# EAGLE design magnetorquer_board (EAGLE 8.4.1)
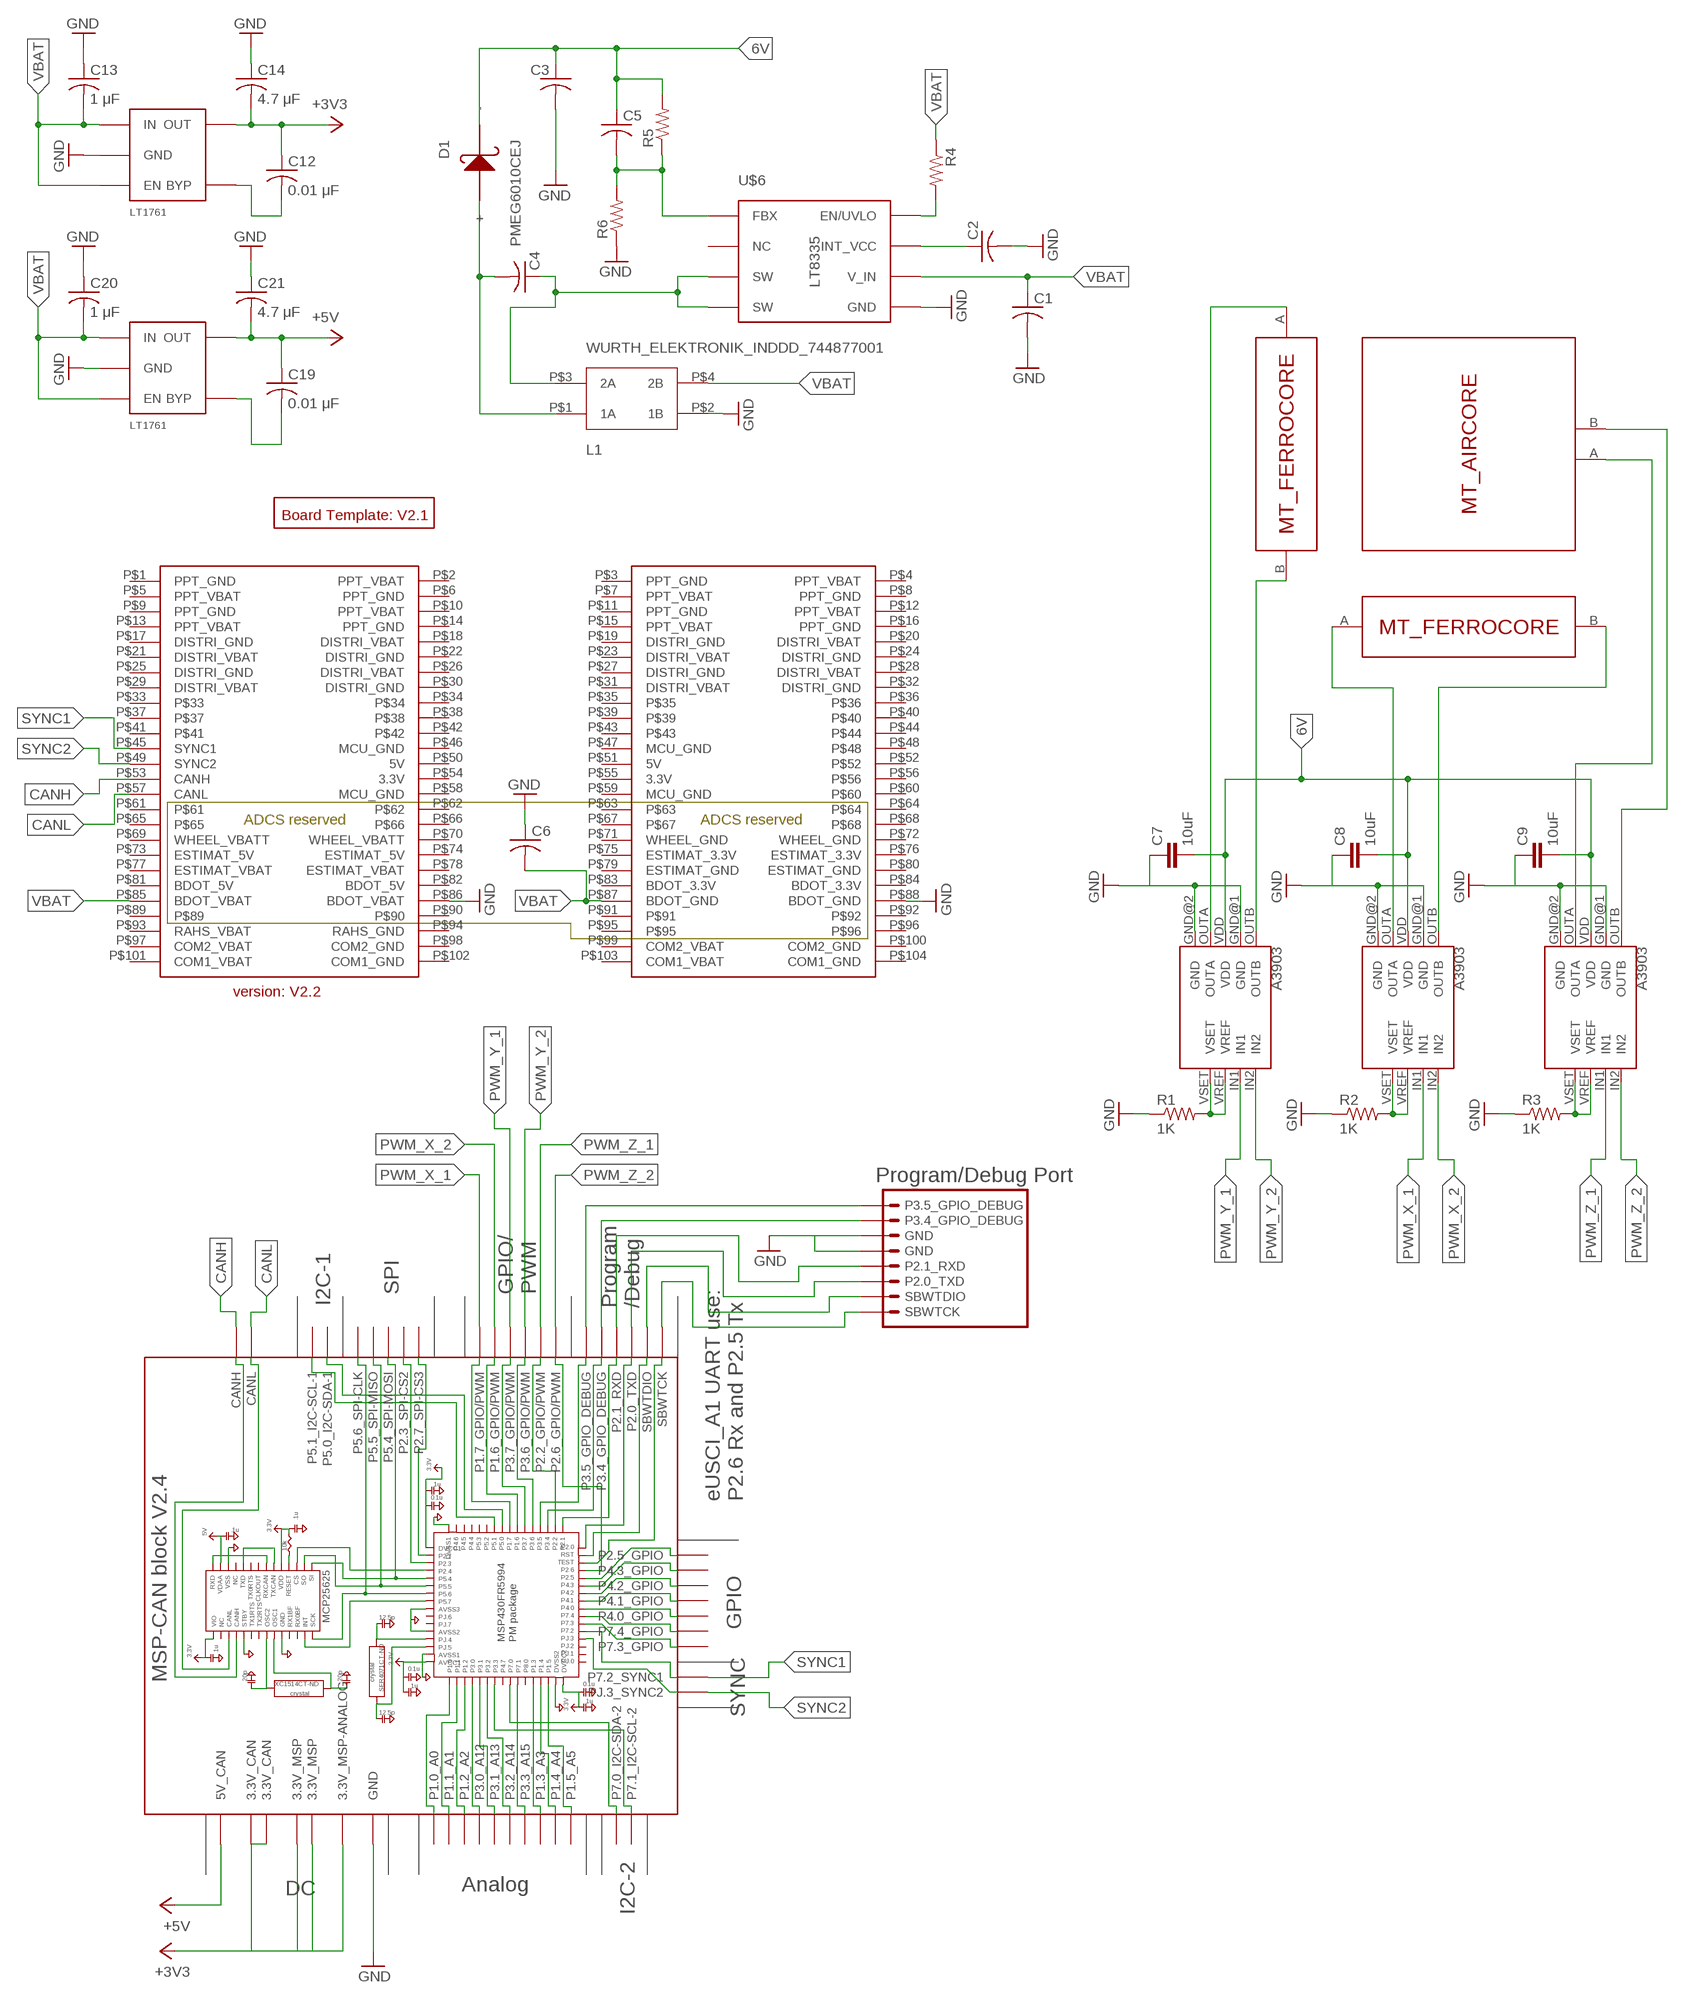
[diagram p0: schematic, sheet 1]

## Parts
C1  C-USC0805  [C0805]
C2  C-USC0805  [C0805]
C3  C-USC0805  [C0805]
C4  C-USC0805  [C0805]
C5  C-USC0805  [C0805]
C6  C-USC0805  [C0805]
C7  10uF  C-EUC0805  [C0805]
C8  10uF  C-EUC0805  [C0805]
C9  10uF  C-EUC0805  [C0805]
C12  0.01 μF  C-USC0805  [C0805]
C13  1 μF  C-USC0805  [C0805]
C14  4.7 μF  C-USC0805  [C0805]
C19  0.01 μF  C-USC0805  [C0805]
C20  1 μF  C-USC0805  [C0805]
C21  4.7 μF  C-USC0805  [C0805]
D1  PMEG6010CEJ  [SC-90]
L1  WURTH_ELEKTRONIK_INDDD_744877001  [WURTH_ELEKTRONIK_INDDD_744877001]
LDO_3V1  LINEAR_LDO_LT1761-X  [SOT-23-5]
LDO_5V1  LINEAR_LDO_LT1761-X  [SOT-23-5]
R1  1K  R-US_R0603  [R0603]
R2  1K  R-US_R0603  [R0603]
R3  1K  R-US_R0603  [R0603]
R4  R-US_R0805  [R0805]
R5  R-US_R0805  [R0805]
R6  R-US_R0805  [R0805]
U1  A3903  [DFN-8EE]
U2  A3903  [DFN-8EE]
U3  A3903  [DFN-8EE]
U$1  PC104_CONNECTOR  [PC104_CONNECTOR]
U$2  BOARD_TEMPLATE  [BOARD_TEMPLATE]
U$3  MT_AIRCORE  [MT_AIRCORE]
U$4  MT_FERROCORE  [MT_FERROCORE]
U$5  MT_FERROCORE  [MT_FERROCORE]
U$6  LT8335  [DDB]
U$7  MSP-CAN_BLOCK  [MSP-CAN_BLOCK]
U$8  PROGRAM/DEBUG_PORT  [1X08_CONNECTOR]

## Nets
6V: C3.1 C5.1 C7.2 C8.2 C9.2 D1.P$2(-) R5.2 U1.VDD U2.VDD U3.VDD
+3V3: C12.1 C14.2 LDO_3V1.P$5(OUT) U$7.3.3V@CAN1(3.3V_CAN) U$7.3.3V@CAN2(3.3V_CAN) U$7.3.3V@MSP1(3.3V_MSP) U$7.3.3V@MSP2(3.3V_MSP) U$7.3.3V_ANALOG@MSP2(3.3V_MSP-ANALOG)
+5V: C19.1 C21.2 LDO_5V1.P$5(OUT) U$7.5V(5V_CAN)
CANH: U$1.P$53(CANH) U$7.CANH
CANL: U$1.P$57(CANL) U$7.CANL
EN_UVLO: R4.2 U$6.P$8(EN/UVLO)
FBX: C5.2 R5.1 R6.2 U$6.P$1(FBX)
GND: C1.2 C2.2 C3.2 C6.1 C7.1 C8.1 C9.1 C13.1 C14.1 C20.1 C21.1 L1.P$2(1B) LDO_3V1.P$2(GND) LDO_5V1.P$2(GND) R1.1 R2.1 R3.1 R6.1 U1.GND@1(GND) U1.GND@2(GND) U2.GND@1(GND) U2.GND@2(GND) U3.GND@1(GND) U3.GND@2(GND) U$1.P$86(BDOT_VBAT) U$1.P$88(BDOT_GND) U$6.GND U$6.P$5(GND) U$7.GND@1(GND) U$7.GND@2(GND) U$7.GND@3(GND) U$7.GND@4(GND) U$7.GND@5(GND) U$7.GND@7(GND) U$7.GND@8(GND) U$7.GND@9(GND) U$7.GND@10(GND) U$7.GND@11(GND) U$7.GND@12(GND) U$7.GND@13(GND) U$7.GND@14(GND) U$7.GND@15(GND) U$7.GND@16(GND) U$7.GND@17(GND) U$7.GND@26(GND) U$8.5(GND) U$8.6(GND)
INT_VCC: C2.1 U$6.P$7(INT_VCC)
N$1: R1.2 U1.VREF U1.VSET
N$2: R2.2 U2.VREF U2.VSET
N$4: C12.2 LDO_3V1.P$4(BYP)
N$6: C4.2 D1.P$1(+) L1.P$1(1A)
N$7: R3.2 U3.VREF U3.VSET
N$8: C19.2 LDO_5V1.P$4(BYP)
N$10: U1.OUTB U$4.B
N$11: U1.OUTA U$4.A
N$12: U2.OUTA U$5.A
N$13: U2.OUTB U$5.B
N$14: U3.OUTB U$3.B
N$15: U3.OUTA U$3.A
N$27: U$7.SBWTCK U$8.SBWTCK
N$28: U$7.SBWTDIO U$8.2(SBWTDIO)
N$29: U$7.P2.0_TXD U$8.3(P2.0_TXD)
N$30: U$7.P2.1_RXD U$8.4(P2.1_RXD)
N$31: U$7.P3.4_GPIO_DEBUG U$8.7(P3.4_GPIO_DEBUG)
N$32: U$7.P3.5_GPIO_DEBUG U$8.8(P3.5_GPIO_DEBUG)
PWM_X_1: U2.IN1 U$7.P1.7_GPIO/PWM
PWM_X_2: U2.IN2 U$7.P1.6_GPIO/PWM
PWM_Y_1: U1.IN1 U$7.P3.7_GPIO/PWM
PWM_Y_2: U1.IN2 U$7.P3.6_GPIO/PWM
PWM_Z_1: U3.IN1 U$7.P2.2_GPIO/PWM
PWM_Z_2: U3.IN2 U$7.P2.6_GPIO/PWM
SW: C4.1 L1.P$3(2A) U$6.P$3(SW) U$6.P$4(SW)
SYNC1: U$1.P$45(SYNC1) U$7.P7.2_SYNC1
SYNC2: U$1.P$49(SYNC2) U$7.PJ.3_SYNC2
VBAT: C1.1 C6.2 C13.2 C20.2 L1.P$4(2B) LDO_3V1.P$1(IN) LDO_3V1.P$3(EN) LDO_5V1.P$1(IN) LDO_5V1.P$3(EN) R4.1 U$1.P$85(BDOT_VBAT) U$1.P$87(BDOT_GND) U$6.P$6(V_IN)
Unconnected: U$1.P$1(PPT_GND) U$1.P$2(PPT_VBAT) U$1.P$3(PPT_GND) U$1.P$4(PPT_VBAT) U$1.P$5(PPT_VBAT) U$1.P$6(PPT_GND) U$1.P$7(PPT_VBAT) U$1.P$8(PPT_GND) U$1.P$9(PPT_GND) U$1.P$10(PPT_VBAT) U$1.P$11(PPT_GND) U$1.P$12(PPT_VBAT) U$1.P$13(PPT_VBAT) U$1.P$14(PPT_GND) U$1.P$15(PPT_VBAT) U$1.P$16(PPT_GND) U$1.P$17(DISTRI_GND) U$1.P$18(DISTRI_VBAT) U$1.P$19(DISTRI_GND) U$1.P$20(DISTRI_VBAT) U$1.P$21(DISTRI_VBAT) U$1.P$22(DISTRI_GND) U$1.P$23(DISTRI_VBAT) U$1.P$24(DISTRI_GND) U$1.P$25(DISTRI_GND) U$1.P$26(DISTRI_VBAT) U$1.P$27(DISTRI_GND) U$1.P$28(DISTRI_VBAT) U$1.P$29(DISTRI_VBAT) U$1.P$30(DISTRI_GND) U$1.P$31(DISTRI_VBAT) U$1.P$32(DISTRI_GND) U$1.P$33 U$1.P$34 U$1.P$35 U$1.P$36 U$1.P$37 U$1.P$38 U$1.P$39 U$1.P$40 U$1.P$41 U$1.P$42 U$1.P$43 U$1.P$44 U$1.P$46(MCU_GND) U$1.P$47(MCU_GND) U$1.P$48 U$1.P$50(5V) U$1.P$51(5V) U$1.P$52 U$1.P$54(3.3V) U$1.P$55(3.3V) U$1.P$56 U$1.P$58(MCU_GND) U$1.P$59(MCU_GND) U$1.P$60 U$1.P$61 U$1.P$62 U$1.P$63 U$1.P$64 U$1.P$65 U$1.P$66 U$1.P$67 U$1.P$68 U$1.P$69(WHEEL_VBATT) U$1.P$70(WHEEL_VBATT) U$1.P$71(WHEEL_GND) U$1.P$72(WHEEL_GND) U$1.P$73(ESTIMAT_5V) U$1.P$74(ESTIMAT_5V) U$1.P$75(ESTIMAT_3.3V) U$1.P$76(ESTIMAT_3.3V) U$1.P$77(ESTIMAT_VBAT) U$1.P$78(ESTIMAT_VBAT) U$1.P$79(ESTIMAT_GND) U$1.P$80(ESTIMAT_GND) U$1.P$81(BDOT_5V) U$1.P$82(BDOT_5V) U$1.P$83(BDOT_3.3V) U$1.P$84(BDOT_3.3V) U$1.P$89 U$1.P$90 U$1.P$91 U$1.P$92 U$1.P$93(RAHS_VBAT) U$1.P$94(RAHS_GND) U$1.P$95 U$1.P$96 U$1.P$97(COM2_VBAT) U$1.P$98(COM2_GND) U$1.P$99(COM2_VBAT) U$1.P$100(COM2_GND) U$1.P$101(COM1_VBAT) U$1.P$102(COM1_GND) U$1.P$103(COM1_VBAT) U$1.P$104(COM1_GND) U$6.P$2(NC) U$7.P1.0_A0 U$7.P1.1_A1 U$7.P1.2_A2 U$7.P1.3_A3 U$7.P1.4_A4 U$7.P1.5_A5 U$7.P2.4_SPI-CS2(P2.3_SPI-CS2) U$7.P2.5_GPIO U$7.P2.7_SPI-CS3 U$7.P3.0_A12 U$7.P3.1_A13 U$7.P3.2_A14 U$7.P3.3_A15 U$7.P4.0_GPIO U$7.P4.1_GPIO U$7.P4.2_GPIO U$7.P4.3_GPIO U$7.P5.0_I2C-SDA-1 U$7.P5.1_I2C-SCL-1 U$7.P5.4_SPI-MOSI U$7.P5.5_SPI-MISO U$7.P5.6_SPI-CLK U$7.P7.0_I2C-SDA-2 U$7.P7.1_I2C-SCL-2 U$7.P7.3_GPIO U$7.P7.4_GPIO

## Library data of the parts
C1-C6 C12-C14 C19-C21 = rcl:C-US: CAPACITOR, American symbol
C7-C9 = rcl:C-EU: CAPACITOR, European symbol
D1 = DubSat1 Components:PMEG6010CEJ
L1 = DubSat1 Components:WURTH_ELEKTRONIK_INDDD_744877001
LDO_3V1 LDO_5V1 = DubSat1 Components:LINEAR_LDO_LT1761-X
R1-R6 = rcl:R-US_: RESISTOR, American symbol
U1-U3 = DubSat1 Components:A3903: Allegro MicroSystems A3903 H-bridge Technical Specifications: Supply voltage: 3-5.5V Operating temperature: -40°C to 85°C Output current: 500mA Digikey: 620-1205-1-ND
U$1 = DubSat1 Components:PC104_CONNECTOR
U$2 = DubSat1 Components:BOARD_TEMPLATE
U$3 = DubSat1 Components:MT_AIRCORE
U$4 U$5 = DubSat1 Components:MT_FERROCORE
U$6 = DubSat1 Components:LT8335
U$7 = DubSat1 Components:MSP-CAN_BLOCK
U$8 = DubSat1 Components:PROGRAM/DEBUG_PORT

## Net classes
0 default: width 0.254 mm, drill 0.254 mm, clearance 0.152 mm

## Board
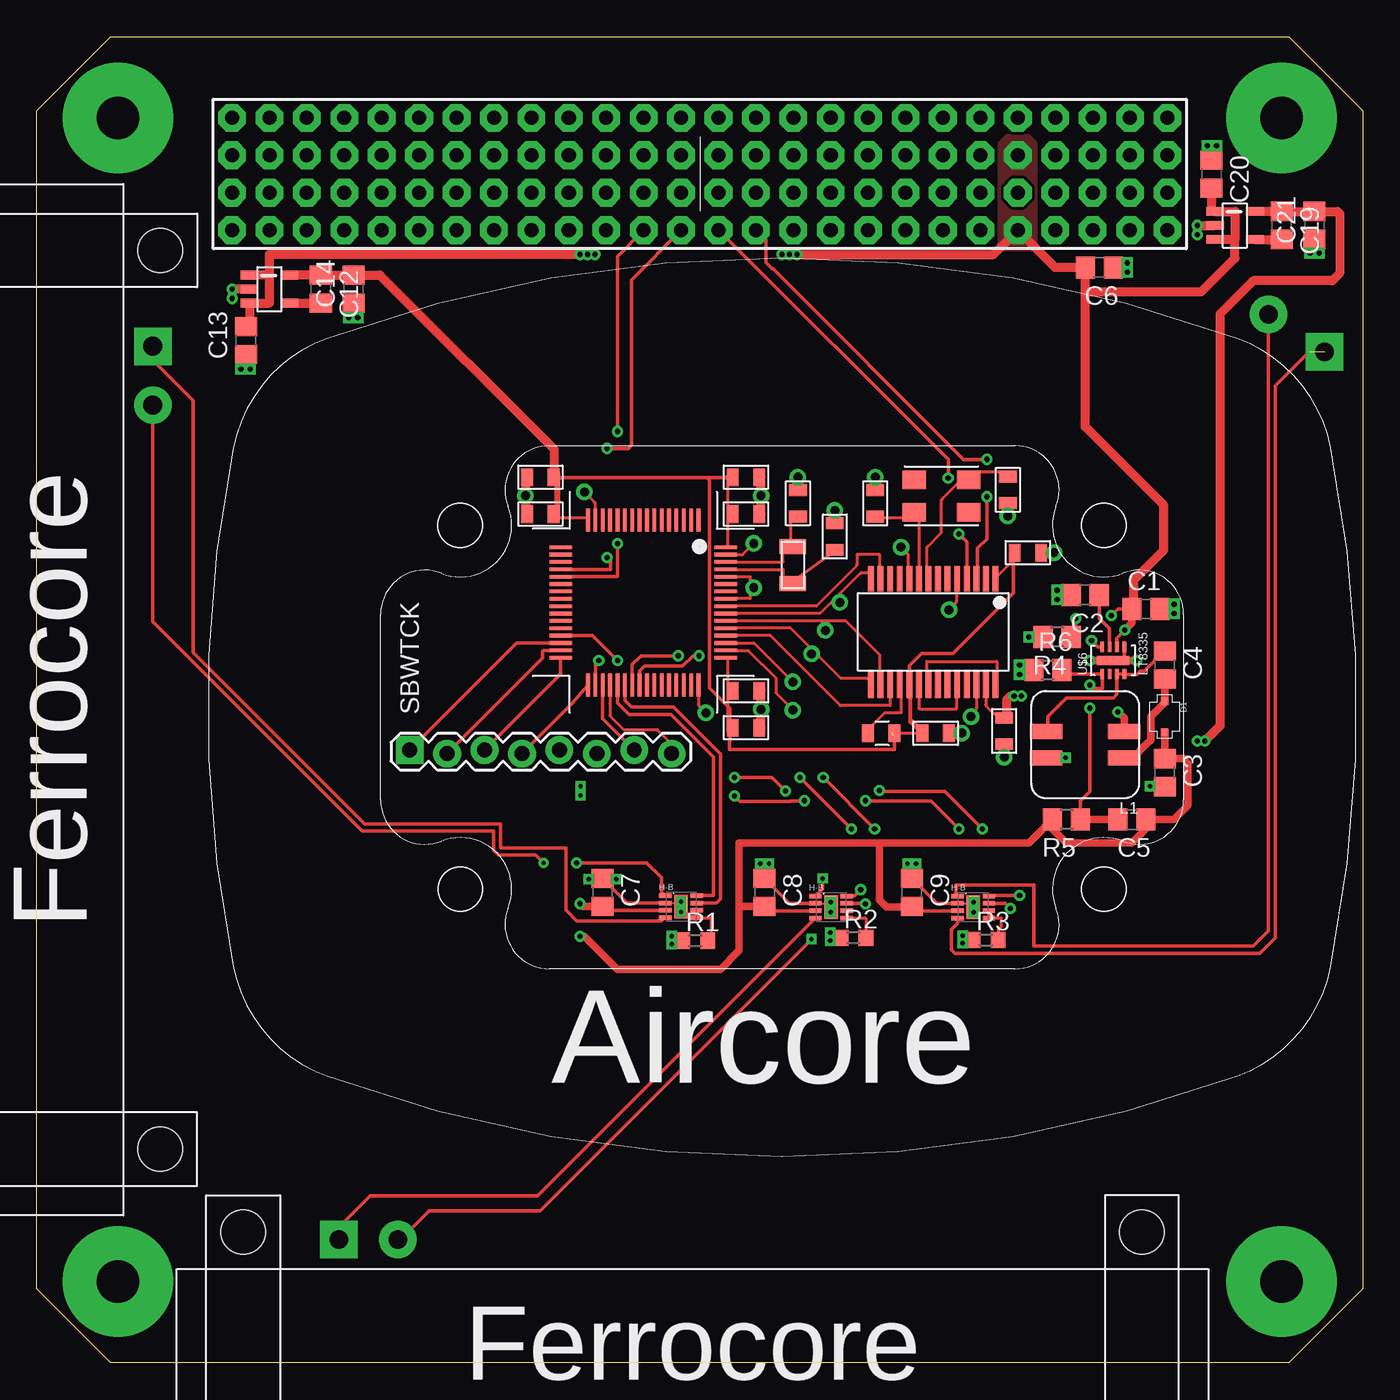
[diagram p1: board, top side]
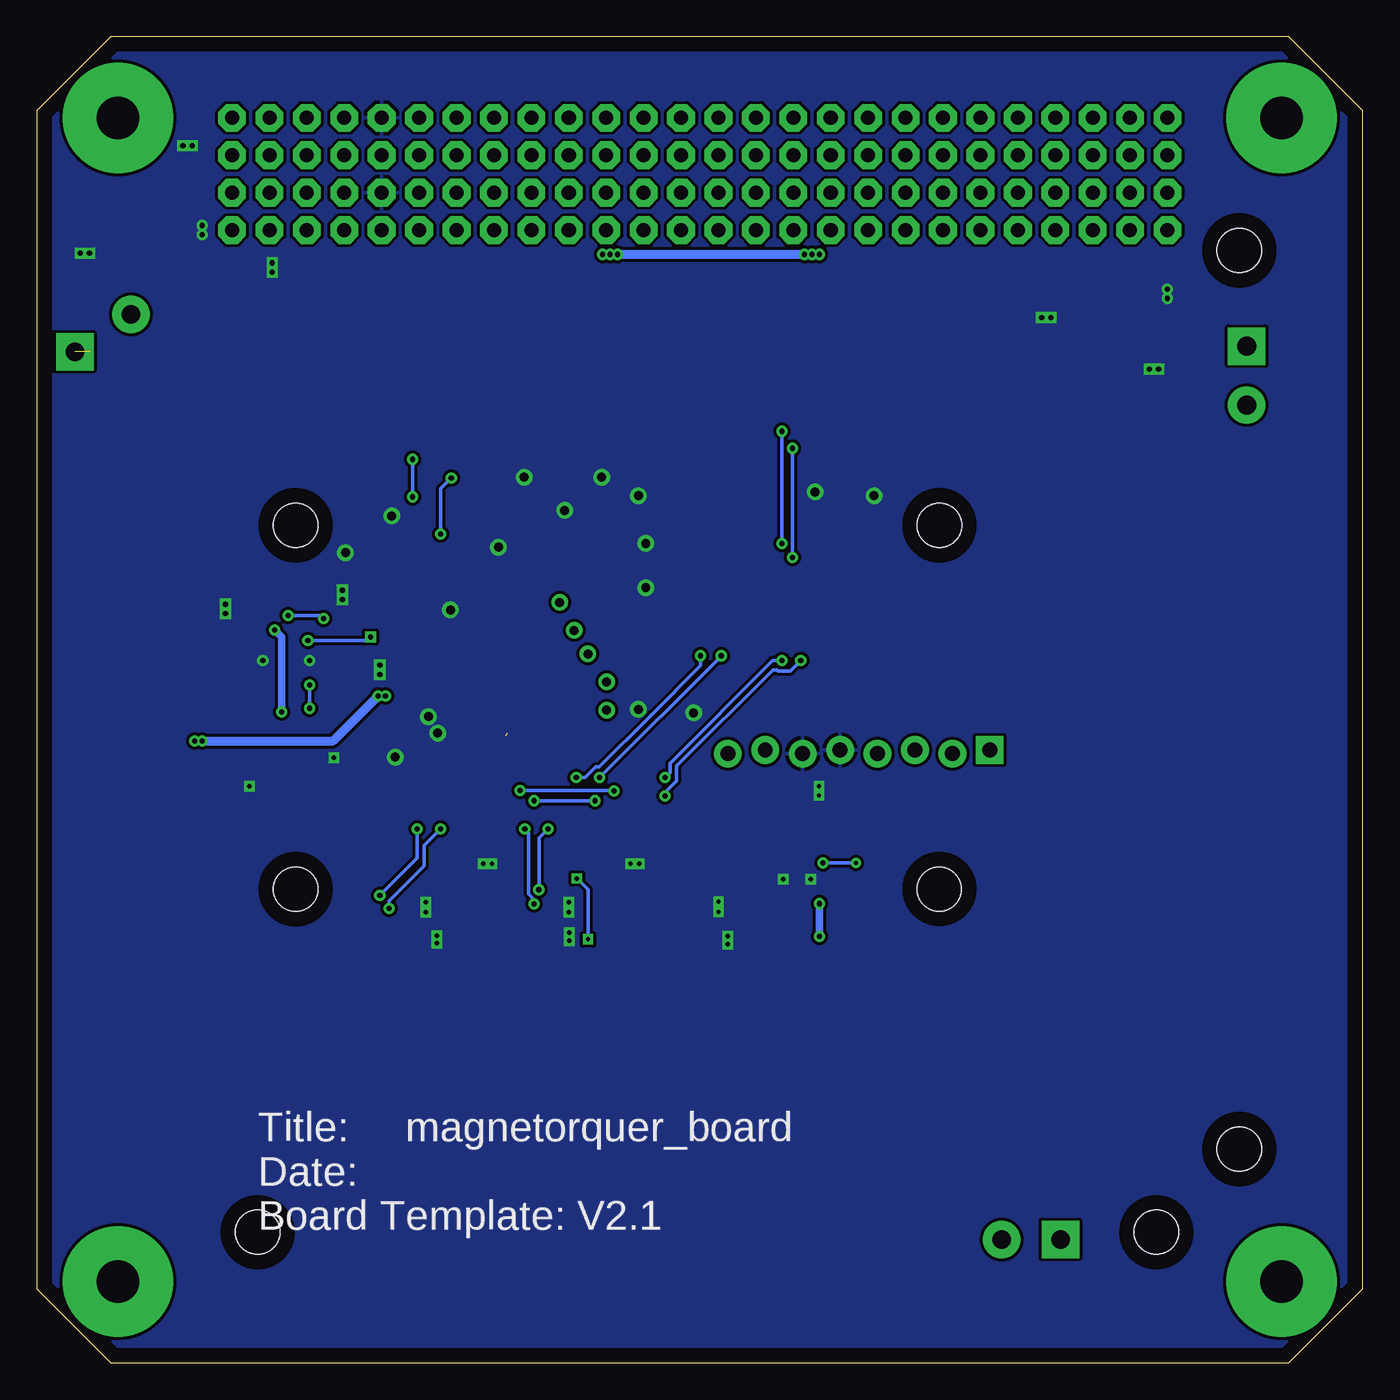
[diagram p2: board, bottom side, seen from below]

Size 90 x 90 mm. Coordinates in mm from the lower left corner, seen from the top.
Copper layers (1*16): Top 0.035mm / dielectric 1.5mm / Bottom 0.035mm
Design rules "default *": minimum track width 8mil, minimum drill 0.4mm, track to track 8mil, track to pad 8mil, pad to pad 8mil, via to via 8mil, smd to smd 0mil, copper to edge 40mil, drill to drill 6mil, minimum pad ring 10mil, minimum via ring 8mil, stop-mask expansion 4mil, vias tented up to drill 0mil, thermal gap 10mil

### Footprints (pad centres in the part's own frame; a part is rotated, then mirrored left to right if it is on the bottom)
C0805 = smd 1.3 x 1.5: 1 -0.95,0; 2 0.95,0
SC-90 = smd 0.5 x 0.5: P$1 -1.05,0; P$2 1.05,0
WURTH_ELEKTRONIK_INDDD_744877001 = smd 1 x 2.2: P$1 -0.9,-2.65; P$2 -0.9,2.65; P$3 0.9,2.65; P$4 0.9,-2.65
SOT-23-5 = smd 0.6 x 1.2: P$1 -0.95,-1.35; P$2 0,-1.35; P$3 0.95,-1.35; P$4 0.95,1.35; P$5 -0.95,1.35
R0603 = smd 1 x 1.1: 1 -0.85,0; 2 0.85,0
R0805 = smd 1.3 x 1.5: 1 -0.95,0; 2 0.95,0
DFN-8EE = smd 0.83 x 0.3: GND@1 -1.065,0.25; IN1 1.065,0.25; IN2 1.065,0.75; OUTA -1.065,-0.75; OUTB -1.065,0.75; VDD -1.065,-0.25; VREF 1.065,-0.25; VSET 1.065,-0.75 | smd 0.9 x 1.6: GND@2 0,0
PC104_CONNECTOR = drill 0.953 pad 1.88 octagon: P$1 -31.75,31.88; P$2 -31.75,34.42; P$3 -31.75,36.96; P$4 -31.75,39.5; P$5 -29.21,31.88; P$6 -29.21,34.42; P$7 -29.21,36.96; P$8 -29.21,39.5; P$9 -26.67,31.88; P$10 -26.67,34.42; P$11 -26.67,36.96; P$12 -26.67,39.5; P$13 -24.13,31.88; P$14 -24.13,34.42; P$15 -24.13,36.96; P$16 -24.13,39.5; P$17 -21.59,31.88; P$18 -21.59,34.42; P$19 -21.59,36.96; P$20 -21.59,39.5; P$21 -19.05,31.88; P$22 -19.05,34.42; P$23 -19.05,36.96; P$24 -19.05,39.5; P$25 -16.51,31.88; P$26 -16.51,34.42; P$27 -16.51,36.96; P$28 -16.51,39.5; P$29 -13.97,31.88; P$30 -13.97,34.42; P$31 -13.97,36.96; P$32 -13.97,39.5; P$33 -11.43,31.88; P$34 -11.43,34.42; P$35 -11.43,36.96; P$36 -11.43,39.5; P$37 -8.89,31.88; P$38 -8.89,34.42; P$39 -8.89,36.96; P$40 -8.89,39.5; P$41 -6.35,31.88; P$42 -6.35,34.42; P$43 -6.35,36.96; P$44 -6.35,39.5; P$45 -3.81,31.88; P$46 -3.81,34.42; P$47 -3.81,36.96; P$48 -3.81,39.5; P$49 -1.27,31.88; P$50 -1.27,34.42; P$51 -1.27,36.96; P$52 -1.27,39.5; P$53 1.27,31.88; P$54 1.27,34.42; P$55 1.27,36.96; P$56 1.27,39.5; P$57 3.81,31.88; P$58 3.81,34.42; P$59 3.81,36.96; P$60 3.81,39.5; P$61 6.35,31.88; P$62 6.35,34.42; P$63 6.35,36.96; P$64 6.35,39.5; P$65 8.89,31.88; P$66 8.89,34.42; P$67 8.89,36.96; P$68 8.89,39.5; P$69 11.43,31.88; P$70 11.43,34.42; P$71 11.43,36.96; P$72 11.43,39.5; P$73 13.97,31.88; P$74 13.97,34.42; P$75 13.97,36.96; P$76 13.97,39.5; P$77 16.51,31.88; P$78 16.51,34.42; P$79 16.51,36.96; P$80 16.51,39.5; P$81 19.05,31.88; P$82 19.05,34.42; P$83 19.05,36.96; P$84 19.05,39.5; P$85 21.59,31.88; P$86 21.59,34.42; P$87 21.59,36.96; P$88 21.59,39.5; P$89 24.13,31.88; P$90 24.13,34.42; P$91 24.13,36.96; P$92 24.13,39.5; P$93 26.67,31.88; P$94 26.67,34.42; P$95 26.67,36.96; P$96 26.67,39.5; P$97 29.21,31.88; P$98 29.21,34.42; P$99 29.21,36.96; P$100 29.21,39.5; P$101 31.75,31.88; P$102 31.75,34.42; P$103 31.75,36.96; P$104 31.75,39.5
BOARD_TEMPLATE = drill 2.9 pad 7.5: P$1 -39.5,39.5; P$2 -39.5,-39.5; P$3 39.5,-39.5; P$4 39.5,39.5
MT_AIRCORE = drill 1.27 pad 2.54 square: A -36.83,-24.13 | drill 1.27 pad 2.54: B -33.02,-26.67 | hole 3: -21.849,12.352; 21.849,12.344; 21.857,-12.347; -21.849,-12.352
MT_FERROCORE = drill 1.27 pad 2.54 square: A 7,24 | drill 1.27 pad 2.54: B 7,20 | hole 3: 7.5,30.5; 7.5,-30.5
DDB = smd 0.61 x 2.2: GND 0,0 | smd 0.7 x 0.25: P$1 -0.925,0.75; P$2 -0.925,0.25; P$3 -0.925,-0.25; P$4 -0.925,-0.75; P$5 0.925,-0.75; P$6 0.925,-0.25; P$7 0.925,0.25; P$8 0.925,0.75
MSP-CAN_BLOCK = smd 1.2 x 0.8: 1 -6,6.08; 2 -6,7.88; 3 -8.5,6.08; 4 -8.5,7.88; 9 -8.5,-6.08; 10 -8.5,-7.88; 11 -6,-6.08; 12 -6,-7.88; 13 8.5,6.08; 14 8.5,7.88; 15 6,6.08; 16 6,7.88; 23 8.875,18.955; 24 8.875,20.755; 25 8.875,17.045; 26 8.875,15.245; 27 -3.375,25.205; 28 -3.375,27.005 | smd 1 x 0.25: 3.3V@CAN1 -3.375,25.125; 3.3V@CAN2 8.875,18.875; 3.3V@MSP1 8.501,5.884; 3.3V@MSP2 -8.533,-5.962; 3.3V_ANALOG@MSP2 -8.482,5.904 | smd 0.8 x 1.2: 5 -5.83,10.5; 6 -7.63,10.5; 7 -3.58,13; 8 -5.38,13; 17 -8.545,24.75; 18 -6.745,24.75; 19 -5.83,15.75; 20 -7.63,15.75; 21 7.83,24.5; 22 9.63,24.5 | smd 0.25 x 1: 5V 7.65,24.5 | smd 1.75 x 0.4: CANH -1.6,21.96; CANL -1.6,22.61; P$65 -1.6,23.91; P$66 -1.6,23.26; P$69 -1.6,21.31; P$70 -1.6,20.66; P$71 -1.6,20.01; P$72 -1.6,19.36; P$73 -1.6,18.71; P$74 -1.6,18.06; P$75 -1.6,17.41; P$76 -1.6,16.76; P$77 -1.6,16.11; P$78 -1.6,15.46; P$79 5.6,15.46; P$80 5.6,16.11; P$81 5.6,16.76; P$82 5.6,17.41; P$83 5.6,18.06; P$84 5.6,18.71; P$85 5.6,19.36; P$86 5.6,20.01; P$87 5.6,20.66; P$88 5.6,21.31; P$89 5.6,21.96; P$90 5.6,22.61; P$91 5.6,23.26; P$92 5.6,23.91 | drill 0.61: GND@1 -3.375,27.875; GND@2 -5.875,24.75; GND@3 -3.75,17.5; GND@4 0.5,20.75; GND@5 -8.5,15.75; GND@7 -8.5,10.5; GND@8 -7.25,8; GND@9 -4,7.5; GND@10 -1,7.5; GND@11 7.75,22.25; GND@12 10.5,24.5; GND@13 8.875,21.625; GND@14 7.25,8; GND@15 7.5,4.25; GND@16 -7.5,-4; GND@17 -7.25,-8; GND@26 -6.25,13; P2.4_SPI-CS2 5.397,10.16; P2.7_SPI-CS3 7.303,10.16; P5.4_SPI-MOSI 3.487,11.434; P5.5_SPI-MISO 1.9,12.354; P5.6_SPI-CLK 0,13.348 | smd 1.55 x 0.25: P1.0_A0 -5.6,3.75; P1.1_A1 -5.6,3.25; P1.2_A2 -5.6,2.75; P1.3_A3 -5.6,-1.75; P1.4_A4 -5.6,-2.25; P1.5_A5 -5.6,-2.75; P1.6_GPIO/PWM 5.6,-0.75; P1.7_GPIO/PWM 5.6,-0.25; P2.1_RXD 5.6,-3.75; P2.2_GPIO/PWM 5.6,-3.25; P3.0_A12 -5.6,2.25; P3.1_A13 -5.6,1.75; P3.2_A14 -5.6,1.25; P3.3_A15 -5.6,0.75; P3.4_GPIO_DEBUG 5.6,-2.75; P3.5_GPIO_DEBUG 5.6,-2.25; P3.6_GPIO/PWM 5.6,-1.75; P3.7_GPIO/PWM 5.6,-1.25; P5.0_I2C-SDA-1 5.6,0.25; P5.1_I2C-SCL-1 5.6,0.75; P7.0_I2C-SDA-2 -5.6,-0.25; P7.1_I2C-SCL-2 -5.6,-0.75; P$8 -5.6,0.25; P$11 -5.6,-1.25; P$15 -5.6,-3.25; P$16 -5.6,-3.75; P$43 5.6,1.25; P$44 5.6,1.75; P$45 5.6,2.25; P$46 5.6,2.75; P$47 5.6,3.25; P$48 5.6,3.75 | smd 0.25 x 1.55: P2.0_TXD 3.75,-5.6; P2.5_GPIO 1.75,-5.6; P2.6_GPIO/PWM 2.25,-5.6; P4.0_GPIO -0.25,-5.6; P4.1_GPIO 0.25,-5.6; P4.2_GPIO 0.75,-5.6; P4.3_GPIO 1.25,-5.6; P7.2_SYNC1 -1.75,-5.6; P7.3_GPIO -1.25,-5.6; P7.4_GPIO -0.75,-5.6; P$17 -3.75,-5.6; P$18 -3.25,-5.6; P$19 -2.75,-5.6; P$49 3.75,5.6; P$50 3.25,5.6; P$51 2.75,5.6; P$52 2.25,5.6; P$53 1.75,5.6; P$54 1.25,5.6; P$55 0.75,5.6; P$56 0.25,5.6; P$57 -0.25,5.6; P$58 -0.75,5.6; P$59 -1.25,5.6; P$60 -1.75,5.6; P$61 -2.25,5.6; P$62 -2.75,5.6; P$63 -3.25,5.6; P$64 -3.75,5.6; PJ.3_SYNC2 -2.25,-5.6; SBWTCK 2.75,-5.6; SBWTDIO 3.25,-5.6 | smd 1 x 1.8: P$93 -3.79,10.16; P$94 -1.29,10.16 | smd 1.25 x 1.6: P$104 -6.13,18.38; P$105 -6.13,22.08; P$106 -8.33,22.08; P$107 -8.33,18.38
1X08_CONNECTOR = drill 1.016 pad 1.88: 2 2.54,-0.127; 3 5.08,0.127; 4 7.62,-0.127; 5 10.16,0.127; 6 12.7,-0.127; 7 15.24,0.127; 8 17.78,-0.127 | drill 1.016 pad 1.88 square: SBWTCK 0,0.127

### Placement (x,y rotation side)
C1  75.29,51.16 0 top
C2  71.16,52.11 180 top
C3  76.56,40.05 270 top
C4  76.56,47.35 270 top
C5  74.34,36.87 180 top
C6  72.11,74.34 180 top
C7  38.4,31.92 270 top
C8  49.4,31.92 270 top
C9  59.4,31.92 270 top
C12  19.28,72.88 270 top
C13  14.2,69.38 90 top
C14  21.51,72.88 90 top
C19  84.5,77.19 270 top
C20  79.73,80.69 270 top
C21  86.72,77.19 90 top
D1  76.56,43.86 270 top
L1  71.16,41.95 90 top
LDO_3V1  15.79,72.88 270 top
LDO_5V1  81.32,77.19 270 top
R1  44.69,28.64 0 top
R2  55.43,28.84 0 top
R3  64.41,28.69 0 top
R4  69.26,49.25 180 top
R5  69.89,36.87 180 top
R6  68.62,47.03 0 top
U1  43.73,30.95 0 top
U2  53.92,30.93 0 top
U3  63.57,30.93 0 top
U$1  45,45 0 top
U$2  45,45 0 top
U$3  50.59,44.49 180 top
U$4  0.87,45 0 top
U$5  44.51,1.36 90 top
U$6  73.07,47.67 90 top
U$7  41.16,51.6 270 top
U$8  25.32,41.47 0 top

### Tracks (layer width: path | path; a pad name or v marks a point on that pad's centre or on a via)
6V  (via drill 0.35)
  Top 0.254: C8.2 49.7,30.68 U2.VDD | C9.2 59.7,30.68 U3.VDD | C7.2 38.67,30.7 U1.VDD
  Top 0.305: 59.45,30.92 C9.2
  Top 0.508: 59.45,30.92 57.67,30.92 57.19,31.4 57.19,35.28 | D1.P$2 C3.1 77.83,41 78.15,40.68 78.15,37.82 77.19,36.87 C5.1 75.29,36.23 74.34,35.28 69.89,35.28 68.94,36.23 R5.2 67.35,35.28 57.19,35.28 | 57.19,35.28 47.67,35.28 47.67,30.97 | 47.67,30.97 C8.2 | v36.87,28.93 37.19,28.93 39.41,26.71 46.4,26.71 47.67,27.98 47.67,30.97 | v36.87,31.16 37.05,30.97 C7.2
  Bottom 0.508: v36.87,28.93 v36.87,31.16
+3V3  (1 unrouted)
  Top 0.254: 35.25,60.09 U$7.3.3V@MSP2 | 45.45,60.09 U$7.3.3V_ANALOG@MSP2 | 45.45,60.09 35.25,60.09 | 35.28,58.14 35.25,58.18 35.25,59.99 35.25,60.09 | 45.45,60.09 45.66,59.87 45.66,45.79 47.05,44.4 U$7.3.3V@MSP1 47.05,42.19 47.03,42.17 47.03,41.63 58.21,41.63 58.21,42.52 58.14,42.59 | U$7.3.3V@CAN1 66.29,52.24 62.17,48.12 60.06,48.12 59.25,47.31 59.25,45.15 59.27,45.13 59.27,43.49 U$7.3.3V@CAN2
  Top 0.61: LDO_3V1.P$5 C12.1 C14.2 23.29,73.83 35.09,62.02 35.09,60.14 35.25,59.99
+5V  (via drill 0.35)
  Top 0.254: 65.66,43.76 U$7.5V
  Top 0.61: LDO_5V1.P$5 C19.1 C21.2 | C21.2 | C21.2 88.31,78.14 88.43,78.02 88.43,73.96 87.93,73.45 82.59,73.45 80.31,71.16 80.31,43.22 v79.29,42.21 v78.78,42.21 | v66.84,45.25 66.08,45.25 65.83,45 65.83,43.92 65.66,43.76
  Bottom 0.61: v78.78,42.21 69.89,42.21 v66.84,45.25 v66.34,45.25
CANH  (via drill 0.35)
  Top 0.254: v61.86,60.05 61.86,61.31 U$1.P$53 | v62.59,56.24 63.13,55.7 U$7.CANH
  Bottom 0.254: v61.86,60.05 62.59,59.32 v62.59,56.24
CANL  (via drill 0.35)
  Top 0.254: U$1.P$57 49.5,76.22 49.5,74.68 49.91,74.26 49.96,74.26 62.91,61.32 v64.49,61.32 | v64.49,58.78 64.49,55.92 63.86,55.29 63.86,53.29 U$7.CANL
  Bottom 0.254: v64.49,61.32 v64.49,58.78
EN_UVLO  (via drill 0.35)
  Top 0.254: R4.2 v67.35,49.25 | v71.59,49.02 72.03,48.59 U$6.P$8
  Bottom 0.254: v67.35,49.25 67.58,49.02 v71.59,49.02
FBX  (via drill 0.35)
  Top 0.254: R6.2 69.86,46.74 U$6.P$1 72.32,45.76 71.71,45.76 v71.48,45.99 | v71.48,44.42 71.48,38.78 70.84,38.14 R5.1
  Top 0.508: C5.2 R5.1
  Bottom 0.254: v71.48,45.99 v71.48,44.42
GND  (via drill 0.3, 0.35)
  Top 0.152: U1.GND@1 43.64,31.2 v43.73,31.3 U1.GND@2 v43.73,30.6 | U2.GND@1 53.8,31.18 v53.89,31.27 | U3.GND@1 63.5,31.18 63.53,31.21 | 63.53,31.21 v63.59,31.27 | v53.89,30.57 53.89,30.9 U2.GND@2 | 63.59,30.84 v63.59,30.57 | 63.59,30.84 63.59,31.14 63.53,31.21 | U3.GND@2 63.57,30.86 63.59,30.84 | R2.1 54.36,28.8 53.94,28.72 v53.87,28.64
  Top 0.203: v53.87,29.2 54.27,28.8 54.36,28.8 | v53.87,28.64 54.06,28.83 R2.1 | v62.86,28.46 63.09,28.69 R3.1 63.16,28.69 v62.86,29 | v43.09,28.41 43.32,28.64 R1.1 43.4,28.64 v43.09,28.95
  Top 0.254: U2.GND@1 51.09,31.18 C8.1 49.4,33.58 | U3.GND@1 61.1,31.18 C9.1 59.4,33.58 | U1.GND@1 40.07,31.2 C7.1 | U$6.P$5 73.82,47.78 73.7,47.67 U$6.GND | L1.P$2 v69.84,41.05 | v66.72,47.35 67.03,47.03 | v66.72,46.71 67.03,47.03 | 67.03,47.03 R6.1 | v77.19,51.48 76.56,51.48 C1.2 76.56,50.84 v77.19,50.84 | v69.26,51.79 69.89,51.79 70.05,51.95 | 70.05,51.95 C2.2 | v69.26,52.43 69.57,52.43 70.05,51.95 | v49.1,33.88 49.4,33.58 | v49.7,33.88 49.4,33.58 | v59.1,33.88 59.4,33.58 | v59.7,33.88 59.4,33.58 | C7.1 38.45,32.82 v39.33,32.82 | C7.1 38.35,32.82 v37.46,32.82
  Top 0.305: v21.16,70.94 21.29,71.71 21.34,71.77 | 21.34,71.77 C14.1 | v21.8,70.94 21.34,71.52 21.34,71.77 | v13.86,67.45 13.98,68.22 C13.1 14.62,68.02 v14.49,67.45
  Top 0.508: v71.48,47.67 U$6.GND v74.66,47.67 | v75.56,39.14 76.51,39.14 C3.2 | v74.02,74.02 73.38,74.02 C6.1 73.7,74.34 v74.02,74.66
  Top 0.61: LDO_3V1.P$2 v13.25,72.88 v13.25,72.24 | LDO_5V1.P$2 v78.78,77.19 v78.78,76.56 | v86.43,75.32 86.72,75.61 C21.1 86.72,75.66 v87.06,75.32 | v79.44,82.62 79.44,81.93 C20.1 79.74,82.27 v80.08,82.62
  other vias: 36.91,39.14 36.91,38.5
  pour Bottom: -0.21,89.7 89.7,89.7 89.7,0.3 89.2,-0.21 -0.21,-0.21 -0.21,89.2
INT_VCC
  Top 0.254: U$6.P$7 72.82,49.82 72.11,50.52 C2.1
N$1
  Top 0.203: U1.VSET 45.76,30.2 45.76,28.86 R1.2
  Top 0.254: U1.VREF U1.VSET
N$2
  Top 0.203: U2.VSET 55.01,30.2 56.24,30.2 56.28,30.16 R2.2
  Top 0.254: U2.VREF U2.VSET
N$4
  Top 0.61: LDO_3V1.P$4 C12.2
N$6
  Top 0.508: C4.2 D1.P$1 76.56,44.81 75.61,43.86 75.61,42.27 75.29,41.95 74.39,41.05 L1.P$1
N$7
  Top 0.203: U3.VSET 64.66,30.2 65.45,30.2 65.45,29.57 65.26,29.38 R3.2
  Top 0.254: U3.VREF U3.VSET 64.62,30.17
N$8
  Top 0.61: LDO_5V1.P$4 C19.2
N$10  (via drill 0.3, 0.35)
  Top 0.254: U1.OUTB 42.4,31.97 42.4,32.92 41.4,33.92 v36.64,33.92 | v34.4,33.92 33.86,34.47 31.33,34.47 31.02,34.78 31.02,36.1 22.07,36.1 7.87,50.29 U$4.B
  Bottom 0.254: v36.64,33.92 v34.4,33.92
N$11
  Top 0.254: U1.OUTA 42.62,30.2 42.42,29.99 36.65,29.99 35.92,30.72 35.92,34.92 31.52,34.92 31.47,34.97 31.47,36.55 22.25,36.55 10.61,48.2 10.61,65.31 7.87,68.06 U$4.A
N$12
  Top 0.254: U$5.A 20.51,9.21 22.61,11.31 33.98,11.31 U2.OUTA
N$13  (via drill 0.3)
  Top 0.254: U2.OUTB 53.34,32.17 v53.34,32.87 | U$5.B 24.51,7.42 24.61,7.31 24.61,8.31 26.61,10.31 34.16,10.31 v52.59,28.74
  Bottom 0.254: v53.34,32.87 52.59,32.11 v52.59,28.74
N$14
  Top 0.254: U3.OUTB 62.4,31.78 62.4,32.43 67.67,32.43 67.67,28.3 82.59,28.3 83.61,29.31 U$3.B
N$15  (1 unrouted)
  Top 0.254: 62.6,30.18 U3.OUTA 62.5,29.82 62.09,29.41 62.09,28.01 62.32,27.78 65.13,27.78 | 86.38,68.62 84.06,66.31 84.06,28.82 83.03,27.78 65.13,27.78 | 65.23,27.78 65.13,27.78
N$27
  Top 0.254: U$7.SBWTCK 32.57,48.85 U$8.SBWTCK
N$28
  Top 0.254: U$7.SBWTDIO 34.38,48.35 34.33,48.3 34.33,47.82 U$8.2
N$29
  Top 0.254: U$8.3 35.24,46.44 | 35.24,46.44 35.38,46.58 | 35.24,46.44 35.57,46.77 U$7.P2.0_TXD
N$30
  Top 0.254: U$8.4 36.33,44.73 U$7.P2.1_RXD
N$31
  Top 0.254: U$8.7 38.41,43.74 U$7.P3.4_GPIO_DEBUG
N$32
  Top 0.203: U$7.P3.5_GPIO_DEBUG 38.9,44.72 38.9,43.91 39.82,42.99 42.1,42.99 43.09,42 U$8.8
PWM_X_1  (via drill 0.35)
  Top 0.254: U2.IN1 56.21,31.18 v56.24,31.15 | v56.88,36.24 v53.38,39.73 | v44.95,47.98 44.54,47.98 43.83,47.28 41.24,47.28 40.91,46.95 U$7.P1.7_GPIO/PWM
  Bottom 0.254: v56.24,31.15 56.24,31.42 56.63,31.82 56.63,35.99 v56.88,36.24 | 44.95,47.67 44.95,47.53 | 44.95,47.67 v44.95,47.98 | v53.38,39.73 52.8,39.73 52.09,40.44 51.82,40.44 48.35,43.91 | 48.28,43.99 48.35,43.91 | 48.35,43.91 44.95,47.31 44.95,47.67
PWM_X_2  (via drill 0.35)
  Top 0.254: U2.IN2 55.49,31.68 v55.92,32.11 | v55.29,36.24 v51.79,39.73 | v43.54,47.98 41,47.98 40.41,47.4 U$7.P1.6_GPIO/PWM
  Bottom 0.254: v55.92,32.11 55.92,35.6 v55.29,36.24 | v51.79,39.73 v43.54,47.98
PWM_Y_1
  Top 0.254: U1.IN1 46.13,31.2 46.4,31.47 46.4,41.32 43.22,44.49 40.36,44.49 39.91,44.94 U$7.P3.7_GPIO/PWM
PWM_Y_2
  Top 0.254: U1.IN2 45.94,31.7 45.94,41.13 43.06,44.01 40.2,44.01 39.41,44.79 U$7.P3.6_GPIO/PWM
PWM_Z_1  (via drill 0.35)
  Top 0.254: U3.IN1 65.74,31.18 v66.08,30.84 | v62.59,36.24 60.68,38.14 v56.24,38.14 | v52.11,38.14 51.16,38.14 51.11,38.09 47.72,38.09 v47.35,38.46 | v38.14,47.67 37.91,47.44 U$7.P2.2_GPIO/PWM
  Bottom 0.254: v66.08,30.84 66.08,31.35 63.72,33.71 63.72,35.11 v62.59,36.24 | v52.11,38.14 v56.24,38.14 | v47.35,38.46 47.35,38.72 46.58,39.49 46.58,40.49 40.04,47.03 39.77,47.03 39.71,46.96 38.85,46.96 v38.14,47.67
PWM_Z_2  (via drill 0.35)
  Top 0.254: U3.IN2 64.67,31.72 v66.72,31.72 | v64.18,36.24 61.64,38.78 57.27,38.78 v57.19,38.85 | 50.84,38.78 v50.82,38.8 49.9,39.72 v47.35,39.72 | U$7.P2.6_GPIO/PWM 37.73,49.35 v39.41,47.67
  Bottom 0.254: v66.72,31.72 64.18,34.26 v64.18,36.24 | v50.82,38.8 50.87,38.85 v57.19,38.85 | v39.41,47.67 40.05,47.67 47.03,40.68 47.03,40.04 v47.35,39.72
SW
  Top 0.254: L1.P$3 68.62,42.96 68.62,43.86 69.89,45.13 73.07,45.13 73.32,45.38 U$6.P$3 U$6.P$4 73.84,46.71 74.66,46.71 74.9,46.96 75.17,46.96 76.51,48.3 C4.1
SYNC1  (via drill 0.35)
  Top 0.254: U$7.P7.2_SYNC1 39.38,53.35 39.41,53.38 v39.41,55.6 | v39.41,63.22 39.41,75.08 U$1.P$45
  Bottom 0.254: v39.41,55.6 v39.41,63.22
SYNC2  (via drill 0.35)
  Top 0.254: U$7.PJ.3_SYNC2 38.93,53.85 38.96,53.88 38.96,54.4 v38.7,54.65 | v38.7,62.06 40.16,62.06 40.36,62.27 40.36,73.49 U$1.P$49
  Bottom 0.254: v38.7,54.65 v38.7,62.06
VBAT  (via drill 0.35)
  Top 0.254: U$6.P$6 73.32,49.19 v73.86,49.73 | R4.1 70.53,49.25 | R4.1 | C1.1 73.38,51.16 v72.93,50.71 | v70.53,50.52 70.53,49.57 R4.1 | LDO_3V1.P$3 | 14.44,70.57 C13.2 | LDO_5V1.P$1
  Top 0.508: C1.1 74.34,50.21 v73.86,49.73 | L1.P$4 73.81,43.75 v73.38,44.17 | LDO_3V1.P$1 | 79.74,80.05 C20.2
  Top 0.61: LDO_3V1.P$3 15.79,71.92 15.79,73.83 | 15.79,73.83 LDO_3V1.P$1 | LDO_3V1.P$3 14.44,70.57 | LDO_5V1.P$1 81.32,78.15 81.32,76.24 | 81.32,76.25 81.32,76.24 | 81.32,76.25 LDO_5V1.P$3 | LDO_5V1.P$1 79.74,78.38 79.74,80.05 | 15.79,73.83 15.79,75.23 v36.87,75.23 | C1.1 74.46,51.28 74.46,53.13 76.5,55.16 76.5,58.21 71.16,63.54 71.16,72.69 | 71.16,72.69 C6.2 69.13,74.34 U$1.P$85 64.94,75.23 51.35,75.23 | 71.16,72.69 79.04,72.69 81.32,74.97 81.32,76.24 | 81.32,76.24 81.32,76.25 | 51.35,75.23 v50.59,75.23 v51.6,75.23 | v51.1,75.23 51.35,75.23
  Bottom 0.254: v72.93,50.71 70.71,50.71 v70.53,50.52
  Bottom 0.508: v73.38,44.17 73.38,49.25 v73.86,49.73
  Bottom 0.61: v36.87,75.23 v37.38,75.23 v37.89,75.23 v50.59,75.23 v51.1,75.23 v51.6,75.23
  pour Top (no thermals): 65.32,82.85 65.83,83.35 67.35,83.35 67.86,82.85 67.86,75.48 65.32,75.48